# EasyEDA Pro project ProPrj_MiniFoc_AT32F435.epro, schematic 电源保护
Create Date: 2024-02-16; Page Name: P1; Project Name: Mini_ODrive_AT32F435 FOC驱动器; Schematic Name: Schematic3; Update Date: 2024-02-16; Company: 嘉立创EDA; Page Size: A4; Version: V1.0
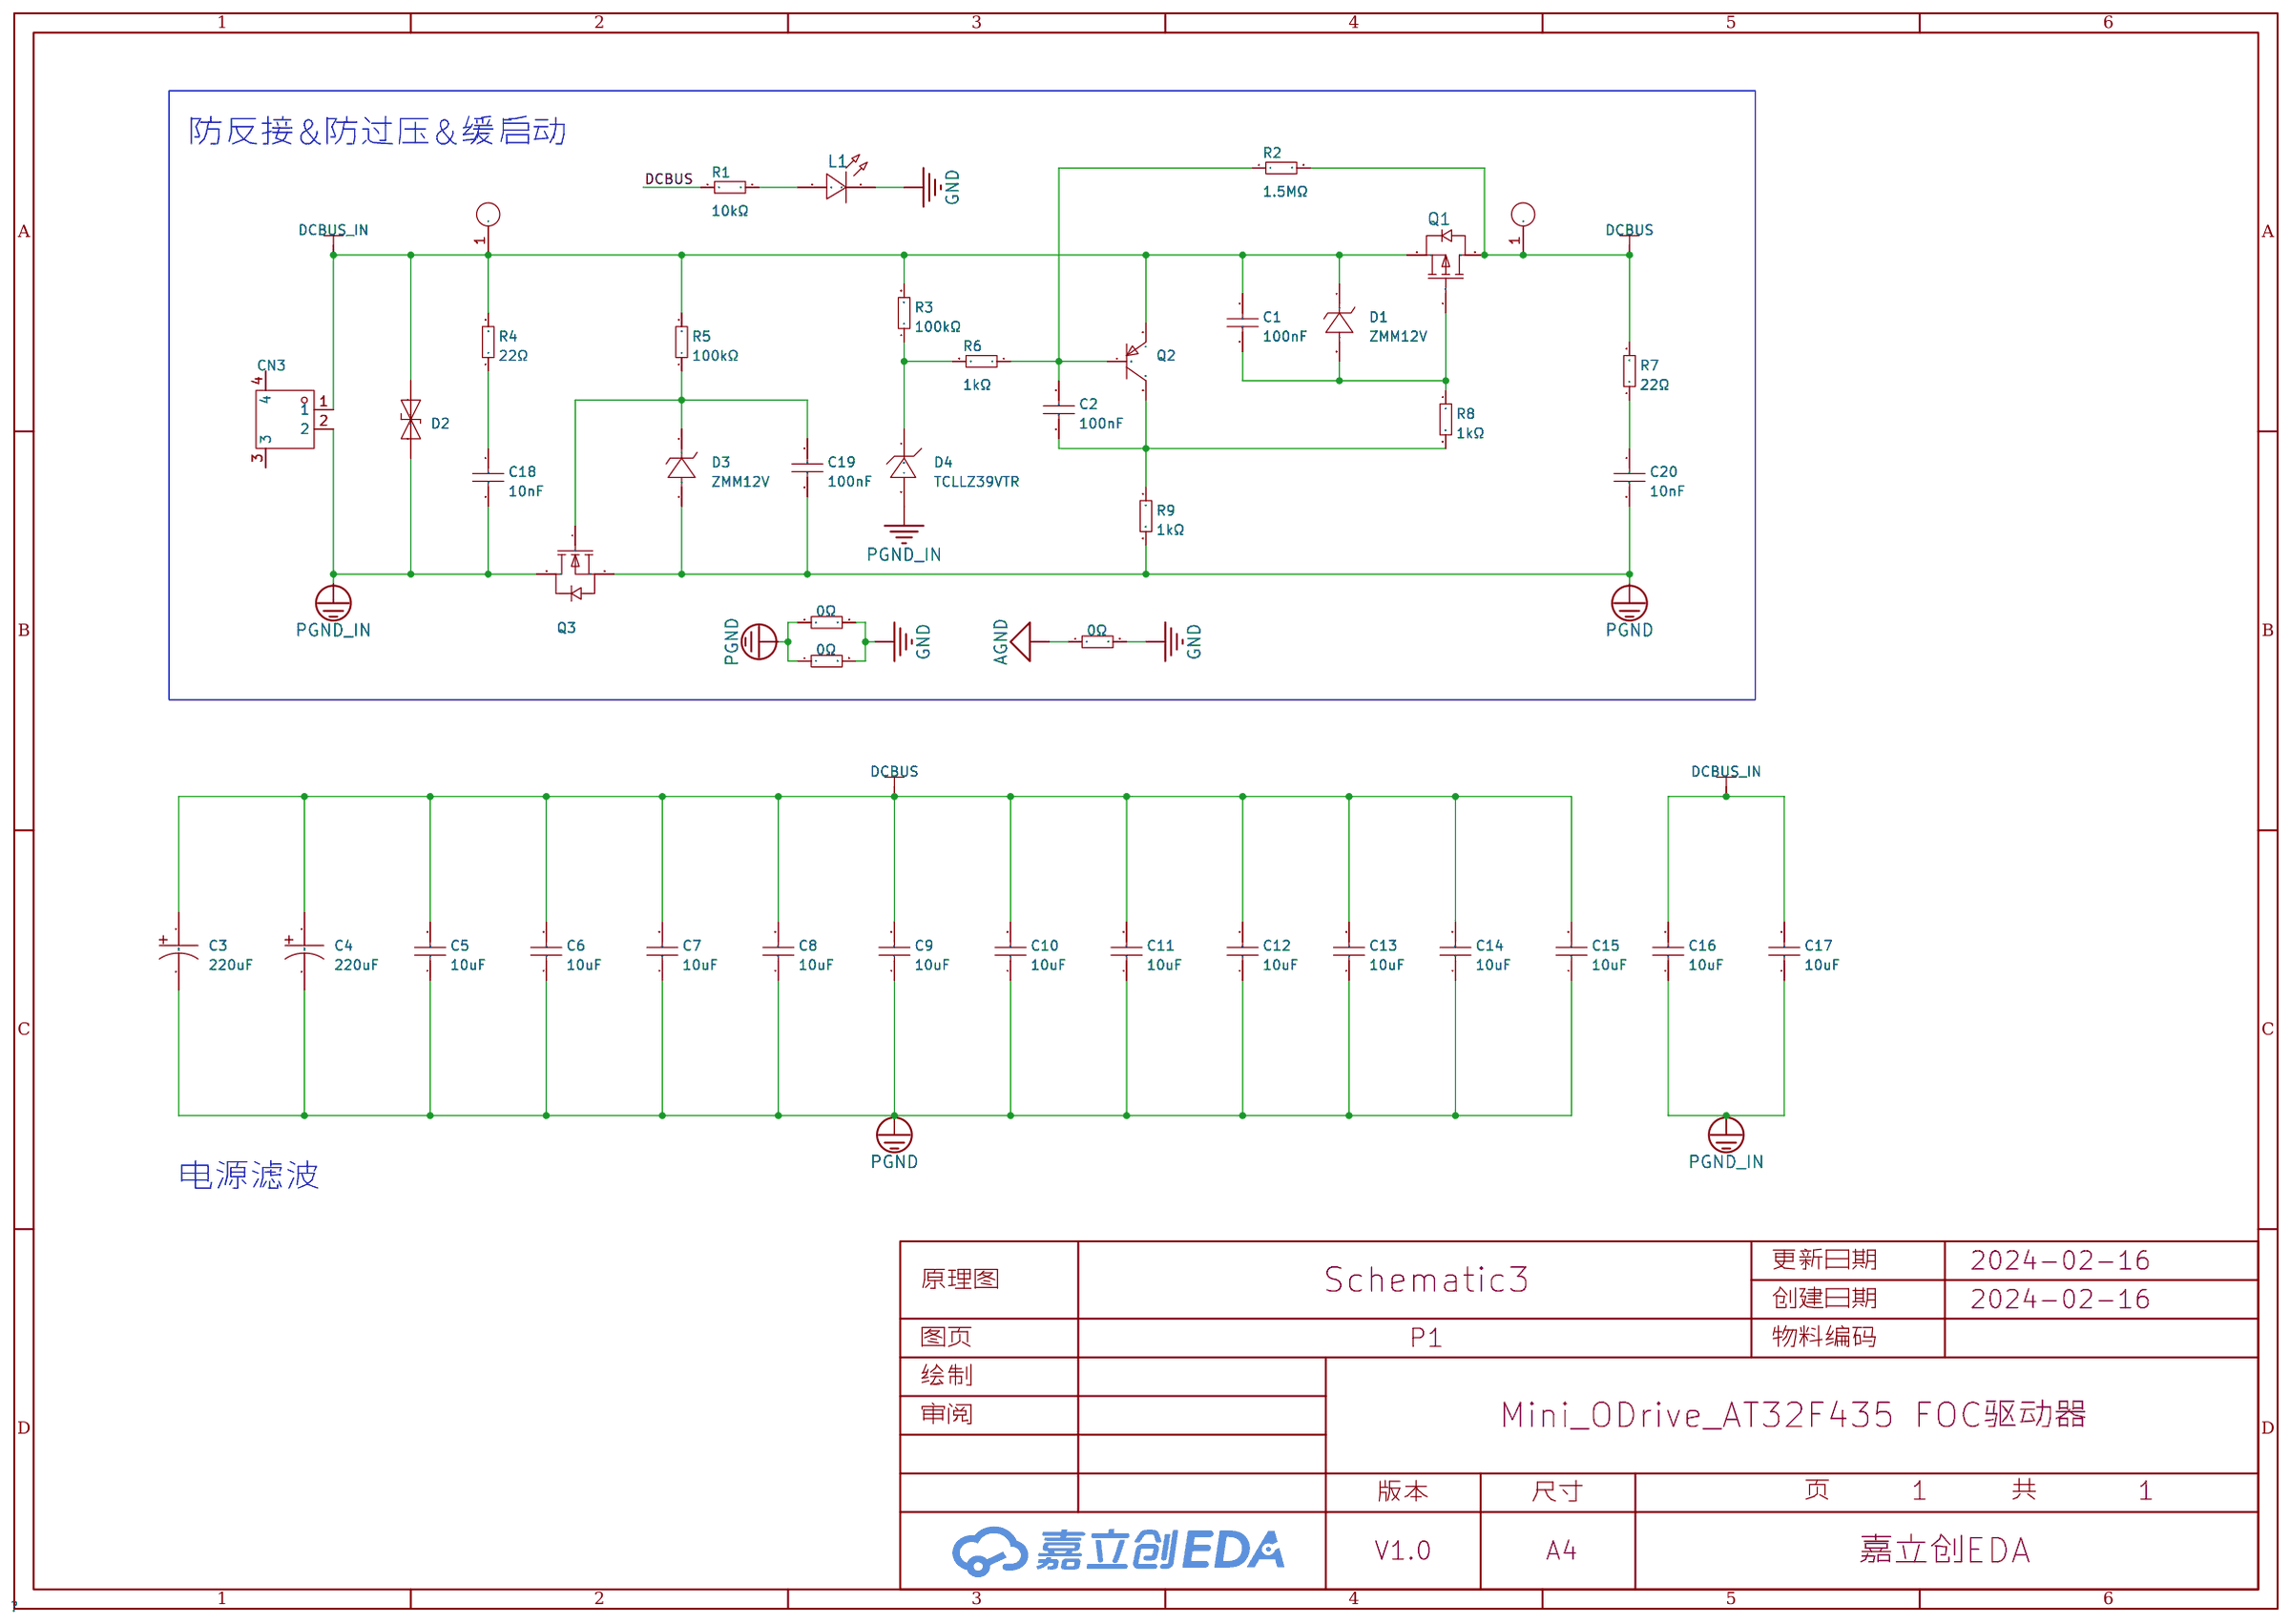
[diagram p2: schematic sheet]

## Parts
C1  100nF  [c0603_s]
C2  100nF  [c0603_s]
C3  220uF  [CAP-SMD_BD10.0-L10.3-W10.3-LS11.0-R-RD]
C4  220uF  [CAP-SMD_BD10.0-L10.3-W10.3-LS11.0-R-RD]
C5  10uF  [c1206_s]
C6  10uF  [c1206_s]
C7  10uF  [c1206_s]
C8  10uF  [c1206_s]
C9  10uF  [c1206_s]
C10  10uF  [c1206_s]
C11  10uF  [c1206_s]
C12  10uF  [c1206_s]
C13  10uF  [c1206_s]
C14  10uF  [c1206_s]
C15  10uF  [c1206_s]
C16  10uF  [c1206_s]
C17  10uF  [c1206_s]
C18  10nF  [c0603_s]
C19  100nF  [c0603_s]
C20  10nF  [c0603_s]
CN1  5012  [testpoint-th_bd2.0_c9900010656]  (no BOM)
CN2  5012  [testpoint-th_bd2.0_c9900010656]  (no BOM)
CN3  XT30PW-F  [conn-th_xt30pw-f]
D1  ZMM12V  [ll-34_l3.5-w1.5-rd-2]
D2  1.5SMC30CAHE3/57T  [SMC_L6.8-W5.9-LS7.8-BI]
D3  ZMM12V  [ll-34_l3.5-w1.5-rd-2]
D4  TCLLZ39VTR  [LL-34_L3.5-W1.5-RD]
L1  NCD0603R1  [led0603_s]
Q1  WSD90P06DN56  [dfn-8_l5.8-w4.9-p1.27-ls6.0-bl-1]
Q2  FMMT593  [SOT-23-3_L2.9-W1.3-P1.90-LS2.4-BR]
Q3  WSD80120DN56  [dfn-8_l5.8-w4.9-p1.27-ls6.0-bl-1]
R1  10kΩ  [r0603_s]
R2  1.5MΩ  [r0603_s]
R3  100kΩ  [r0603_s]
R4  22Ω  [r0603_s]
R5  100kΩ  [r0603_s]
R6  1kΩ  [r0603_s]
R7  22Ω  [r0603_s]
R8  1kΩ  [r0603_s]
R9  1kΩ  [r0603_s]
R10  0Ω  [r0603_s]
R11  0Ω  [r0603_s]
R12  0Ω  [r0603_s]

## Library data of the parts
C1 C2 C19 = 0603B104K500NT: 容值:100nF;精度:±10%;额定电压:50V;材质(温度系数):X7R;; LCSC Part Name: 100nF ±10% 50V; Supplier Part: C30926; Manufacturer: FH(风华); Supplier Footprint: 0603; JLCPCB Part Class: Extended Part; Datasheet: https://atta.szlcsc.com/upload/public/pdf/source/20200305/C486355_26A10D38EF8C2A5C37091D0039909270.pdf; Supplier: LCSC; Tolerance: ±10%; Voltage Rated: 50V; Temperature Coefficient: X7R; Pin Type: IN; Check: true
C3 C4 = 50TZV220M10X10.5: 容值:220uF;精度:±20%;额定电压:50V;纹波电流:402mA@120Hz;等效串联电阻:-;; LCSC Part Name: 220uF ±20% 50V; Supplier Part: C88818; Manufacturer: rubycon(红宝石); Supplier Footprint: SMD,D10xL10.5mm; JLCPCB Part Class: Extended Part; Datasheet: https://atta.szlcsc.com/upload/public/pdf/source/20171014/C108861_15079752546651037911.pdf; Supplier: LCSC; Tolerance: ±20%; Rated Voltage: 50V; Ripple Current: 402mA@120Hz; φD: 10mm; L: 10.5mm; Lifetime @ Temp: 2000hrs@105℃; Operating Temperature: -55℃~+105℃; Check: true
C5-C17 = CL31A106KBHNNNE: 容值:10uF;精度:±10%;额定电压:50V;材质(温度系数):X5R;; LCSC Part Name: 10uF ±10% 50V; Supplier Part: C13585; Manufacturer: SAMSUNG(三星); Supplier Footprint: 1206; JLCPCB Part Class: Basic Part; Datasheet: https://atta.szlcsc.com/upload/public/pdf/source/20160218/1457707763339.pdf; Supplier: LCSC; Tolerance: ±10%; Voltage Rated: 50V; Temperature Coefficient: X5R; Pin Type: IN; 值: 10UF; Check: true
C18 C20 = 0603B103K500NT: 容值:10nF;精度:±10%;额定电压:50V;材质(温度系数):X7R;; LCSC Part Name: 10nF ±10% 50V; Supplier Part: C57112; Manufacturer: FH(风华); Supplier Footprint: 0603; JLCPCB Part Class: Basic Part; Datasheet: https://atta.szlcsc.com/upload/public/pdf/source/20200305/C486355_26A10D38EF8C2A5C37091D0039909270.pdf; Supplier: LCSC; Tolerance: ±10%; Voltage Rated: 50V; Temperature Coefficient: X7R; Pin Type: IN; Check: true
CN1 CN2 = 5012: LCSC Part Name: 测试点; Supplier Part: C2906766; Manufacturer: Keystone; JLCPCB Part Class: ExtendedPart; Datasheet: https://atta.szlcsc.com/upload/public/pdf/source/20211102/12102DF701EA335825673F0350517149.pdf; Supplier: LCSC; Check: true
CN3 = XT30PW-F: 类别:-;类型1:-;; LCSC Part Name: AMASS(艾迈斯)电源连接器 母头 XT30PW-F; Supplier Part: C2913282; Manufacturer: AMASS(艾迈斯); JLCPCB Part Class: Extended Part; Datasheet: https://atta.szlcsc.com/upload/public/pdf/source/20190916/C428722_DFF78979486FCB0B58C1FC563067EC88.pdf; Supplier: LCSC; Brand: 艾迈斯; Type: 航模插头; InterfaceType: 母头; Check: true
D1 D3 = ZMM12V: 二极管配置:独立式;稳压值(标称值):12V;稳压值(范围):11.4V~12.7V;功率:500mW;精度:±5%;; Supplier Part: C2891753; Manufacturer: YONGYUTAI(永裕泰); Supplier Footprint: LL-34; JLCPCB Part Class: Extended Part; Datasheet: https://atta.szlcsc.com/upload/public/pdf/source/20210901/1E62BEB6ADBB84BC625F53DAC2865793.pdf; Supplier: LCSC; Diode Configuration: 独立式; Zener Voltage (Nom): 12V; Zener Voltage (Range): 11.4V~12.7V; Power Dissipation: 500mW; Zener Impedance (Zzt): 20Ω; Tolerance: ±5%; Check: true
D2 = 1.5SMC30CAHE3/57T: Supplier Part: C266791; Manufacturer: VISHAY(威世); Supplier Footprint: DO-214AB; JLCPCB Part Class: ExtendedPart; Datasheet: https://atta.szlcsc.com/upload/public/pdf/source/20201127/C266791_DCFCBF6E8C40544EF502CA57B31F9E9C.pdf; Supplier: LCSC; Check: true
D4 = TCLLZ39VTR: 二极管配置:独立式;稳压值(标称值):39V;精度:±5%;功率:500mW;; Supplier Part: C261065; Manufacturer: TC(德昌); Supplier Footprint: LL-34; JLCPCB Part Class: Extended Part; Datasheet: https://atta.szlcsc.com/upload/public/pdf/source/20180730/C261180_0E55EF1E5C6C97B03D9678EA0A24BCDF.pdf; Supplier: LCSC; Diode Configuration: 独立式; Zener Voltage (Nom): 39V; Tolerance: ±5%; Power Dissipation: 500mW; Reverse Leakage Current (Ir): 200nA@30V; Zener Impedance (Zzt): 85Ω; Zener Voltage (Range): 31V~35V; Check: true
L1 = NCD0603R1_C84263: 发光颜色:红色;功率:65mW;透镜颜色:无色透明;主波长:615nm~630nm;发光强度:80mcd~220mcd;发光角度:130°;工作温度:-30℃~+85℃;; LCSC Part Name: 红灯 0603红灯   正贴; Supplier Part: C84263; Manufacturer: 国星光电; Supplier Footprint: 0603; JLCPCB Part Class: Extended Part; Datasheet: https://atta.szlcsc.com/upload/public/pdf/source/20200820/C84263_DABC6A75E58F576973B407FDBA283D60.pdf; Supplier: LCSC; Emitted Color: 红色; Forward Voltage (VF): 1.6V~2.6V; Forward Current: 20mA; Power Dissipation: 65mW; Lens Color: 无色透明; Dominant Wavelength: 615nm~630nm; Luminous Intensity: 80mcd~220mcd; Viewing Angle: 130°; Operating Temperature: -30℃~+85℃; Check: true
Q1 = WSD90P06DN56: 类型:P沟道;漏源电压(Vdss):60V;连续漏极电流(Id):90A;功率(Pd):96W;导通电阻(RDS(on)@Vgs,Id):10.5mΩ@10V,30A;阈值电压(Vgs(th)@Id):1.85V@250uA;; LCSC Part Name: P沟道 耐压:60V 电流:90A; Supplier Part: C719104; Manufacturer: WINSOK(微硕); Supplier Footprint: PDFN-8(4.9x5.8); JLCPCB Part Class: Extended Part; Datasheet: https://atta.szlcsc.com/upload/public/pdf/source/20220729/279518A307255699200471987C1169DA.pdf; Supplier: LCSC; Type: P沟道; Drain Source Voltage (Vdss): 60V; Continuous Drain Current (Id): 90A; Power Dissipation (Pd): 96W; Drain Source On Resistance (RDS(on)@Vgs,Id): 10.5mΩ@10V,30A; Gate Threshold Voltage (Vgs(th)@Id): 1.85V@250uA; Total Gate Charge (Qg@Vgs): 121nC@10V; Input Capacitance (Ciss@Vds): 5.6nF@30V; Reverse Transfer Capacitance (Crss@Vds): 480pF@30V; Operating Temperature: -55℃~+150℃@(Tj); Check: true
Q2 = FMMT593: 晶体管类型:PNP;集射极击穿电压(Vceo):100V;集电极电流(Ic):1A;功率(Pd):250mW;集电极-发射极饱和电压(VCE(sat)@Ic,Ib):300mV@500mA,50mA;直流电流增益(hFE@Ic,Vce):100@500mA,5V;特征频率(fT):150MHz;工作温度:+150@(Tj);; Supplier Part: C686648; Manufacturer: PJSEMI(平晶微); Supplier Footprint: SOT-23; JLCPCB Part Class: ExtendedPart; Datasheet: https://atta.szlcsc.com/upload/public/pdf/source/20200623/C686648_1A1010DCFFDFD669E9C9C5EDEB156CF4.pdf; Supplier: LCSC; Transistor Type: PNP; Collector-Emitter Breakdown Voltage (Vceo): 100V; Collector Current (Ic): 1A; Power Dissipation (Pd): 250mW; Collector-Emitter Saturation Voltage (VCE(sat)@Ic,Ib): 300mV@500mA,50mA; DC Current Gain (hFE@Ic,Vce): 100@500mA,5V; Transition Frequency (fT): 150MHz; Operating Temperature: +150@(Tj); Check: true
Q3 = WSD80120DN56: Configuration Single Type N-Ch VDS(V) 85 VGS(V) 25 ID(A)Max. 120 VGS(th)(v) 3 RDS(ON)(m?)@4.218V - Qg(nC)@4.5V - QgS(nC) 17 Qgd(nC) 11 Ciss(pF) 3750 Coss(pF) 395 Crss(pF) 180; Supplier Part: C2880467; Manufacturer: WINSOK(微硕); Supplier Footprint: DFN-8(4.9x5.8); JLCPCB Part Class: Extended Part; Datasheet: https://atta.szlcsc.com/upload/public/pdf/source/20210813/DD2210B50993633CFB622FAE7AD52E64.pdf; Supplier: LCSC; Check: true
R1 = 0603WAF1002T5E: 阻值:10kΩ;精度:±1%;功率:100mW;温度系数:±100ppm/℃;电阻类型:厚膜电阻;; LCSC Part Name: 10kΩ ±1% 100mW 厚膜电阻; Supplier Part: C25804; Manufacturer: UNI-ROYAL(厚声); Supplier Footprint: 0603; JLCPCB Part Class: Basic Part; Datasheet: https://atta.szlcsc.com/upload/public/pdf/source/20200306/C422600_1E6D84923E4A46A82E41ADD87F860B5C.pdf; Supplier: LCSC; Tolerance: ±1%; Power(Watts): 100mW; Overload Voltage (Max): 75V; Temperature Coefficient: ±100ppm/℃; Type: 厚膜电阻; Operating Temperature Range: -55℃~+155℃; Pin Type: IN; Check: true
R2 = RS-03L1504FT: 电阻类型:厚膜电阻;阻值:1.5MΩ;精度:±1%;功率:100mW;最大工作电压:50V;温度系数:±250ppm/℃;; LCSC Part Name: 1.5MΩ ±1% 100mW; Supplier Part: C322057; Manufacturer: FH(风华); Supplier Footprint: 0603; JLCPCB Part Class: Extended Part; Datasheet: https://atta.szlcsc.com/upload/public/pdf/source/20140616/1457707091974.pdf; Supplier: LCSC; Type: 厚膜电阻; Tolerance: ±1%; Power(Watts): 100mW; Overload Voltage (Max): 50V; Temperature Coefficient: ±250ppm/℃; Operating Temperature Range: -55℃~+155℃; Pin Type: IN; Check: true
R3 R5 = RS-03K1003FT: 阻值:100kΩ;功率:100mW;温度系数:±100ppm/℃;精度:±1%;; LCSC Part Name: 100kΩ ±1% 100mW; Supplier Part: C115320; Manufacturer: FH(风华); Supplier Footprint: 0603; JLCPCB Part Class: Extended Part; Datasheet: https://atta.szlcsc.com/upload/public/pdf/source/20140616/1457707091974.pdf; Supplier: LCSC; Power(Watts): 100mW; Overload Voltage (Max): 50V; Temperature Coefficient: ±100ppm/℃; Tolerance: ±1%; Operating Temperature Range: -55℃~+155℃; Pin Type: IN; Check: true
R4 R7 = 0603WAF220JT5E: 阻值:22Ω;精度:±1%;功率:100mW;温度系数:±100ppm/℃;电阻类型:厚膜电阻;; LCSC Part Name: 22Ω ±1% 100mW 厚膜电阻; Supplier Part: C23345; Manufacturer: UNI-ROYAL(厚声); Supplier Footprint: 0603; JLCPCB Part Class: Basic Part; Datasheet: https://atta.szlcsc.com/upload/public/pdf/source/20200306/C422600_1E6D84923E4A46A82E41ADD87F860B5C.pdf; Supplier: LCSC; Tolerance: ±1%; Power(Watts): 100mW; Overload Voltage (Max): 75V; Temperature Coefficient: ±100ppm/℃; Type: 厚膜电阻; Operating Temperature Range: -55℃~+155℃; Pin Type: IN; Check: true
R6 R8 R9 = RC0603FR-071KL: 电阻类型:厚膜电阻;阻值:1kΩ;精度:±1%;功率:100mW;; LCSC Part Name: 1kΩ ±1% 100mW; Supplier Part: C22548; Manufacturer: YAGEO(国巨); Supplier Footprint: 0603; JLCPCB Part Class: Extended Part; Datasheet: https://atta.szlcsc.com/upload/public/pdf/source/20180312/7BD3618A8B6324EA6280B0497A051AB7.pdf; Supplier: LCSC; Type: 厚膜电阻; Tolerance: ±1%; Power(Watts): 100mW; Temperature Coefficient: ±100ppm/℃; Overload Voltage (Max): 75V; Operating Temperature Range: -55℃~+155℃; Pin Type: IN; Check: true
R10-R12 = RS-03000FT: 阻值:0Ω;精度:±1%;功率:100mW;; LCSC Part Name: 0Ω ±1% 100mW; Supplier Part: C136582; Manufacturer: FH(风华); Supplier Footprint: 0603; JLCPCB Part Class: Extended Part; Datasheet: https://atta.szlcsc.com/upload/public/pdf/source/20171106/C136582_15099532019501092527.pdf; Supplier: LCSC; Tolerance: ±1%; Power(Watts): 100mW; Overload Voltage (Max): 50V; Operating Temperature Range: -55℃~+155℃; Pin Type: IN; Check: true

## Nets
AGND: R12.1
GND: L1.2 R10.2 R11.2 R12.2
PGND: C3.2 C4.2 C5.1 C6.1 C7.1 C8.1 C9.1 C10.1 C11.1 C12.1 C13.1 C14.1 C15.1 C19.2 C20.2 D3.2(A) Q3.3(S) R9.2 R10.1 R11.1
PGND_IN: C16.1 C17.1 C18.2 CN3.2 D2.1(K) D4.2(A) Q3.2(D)
DCBUS: C3.1 C4.1 C5.2 C6.2 C7.2 C8.2 C9.2 C10.2 C11.2 C12.2 C13.2 C14.2 C15.2 CN2.1 Q1.2(D) R1.2 R2.2 R7.2
DCBUS_IN: C1.1 C16.2 C17.2 CN1.1 CN3.1 D1.1(K) D2.2(A) Q1.3(S) Q2.2(E) R3.2 R4.2 R5.2
Net-(C1-2): C1.2 D1.2(A) Q1.1(G) R8.1
Net-(C2-1): C2.1 Q2.1(B) R2.1 R6.1
Net-(C2-2): C2.2 Q2.3(C) R8.2 R9.1
Net-(C18-1): C18.1 R4.1
Net-(C19-1): C19.1 D3.1(K) Q3.1(G) R5.1
Net-(C20-1): C20.1 R7.1
Net-(D4-1): D4.1(C) R3.1 R6.2
Net-(L1-1): L1.1 R1.1

Not connected (* = marked no-connect by the designer): CN3 3 4

## Notes on the sheet
- 防反接&防过压&缓启动
- 电源滤波
